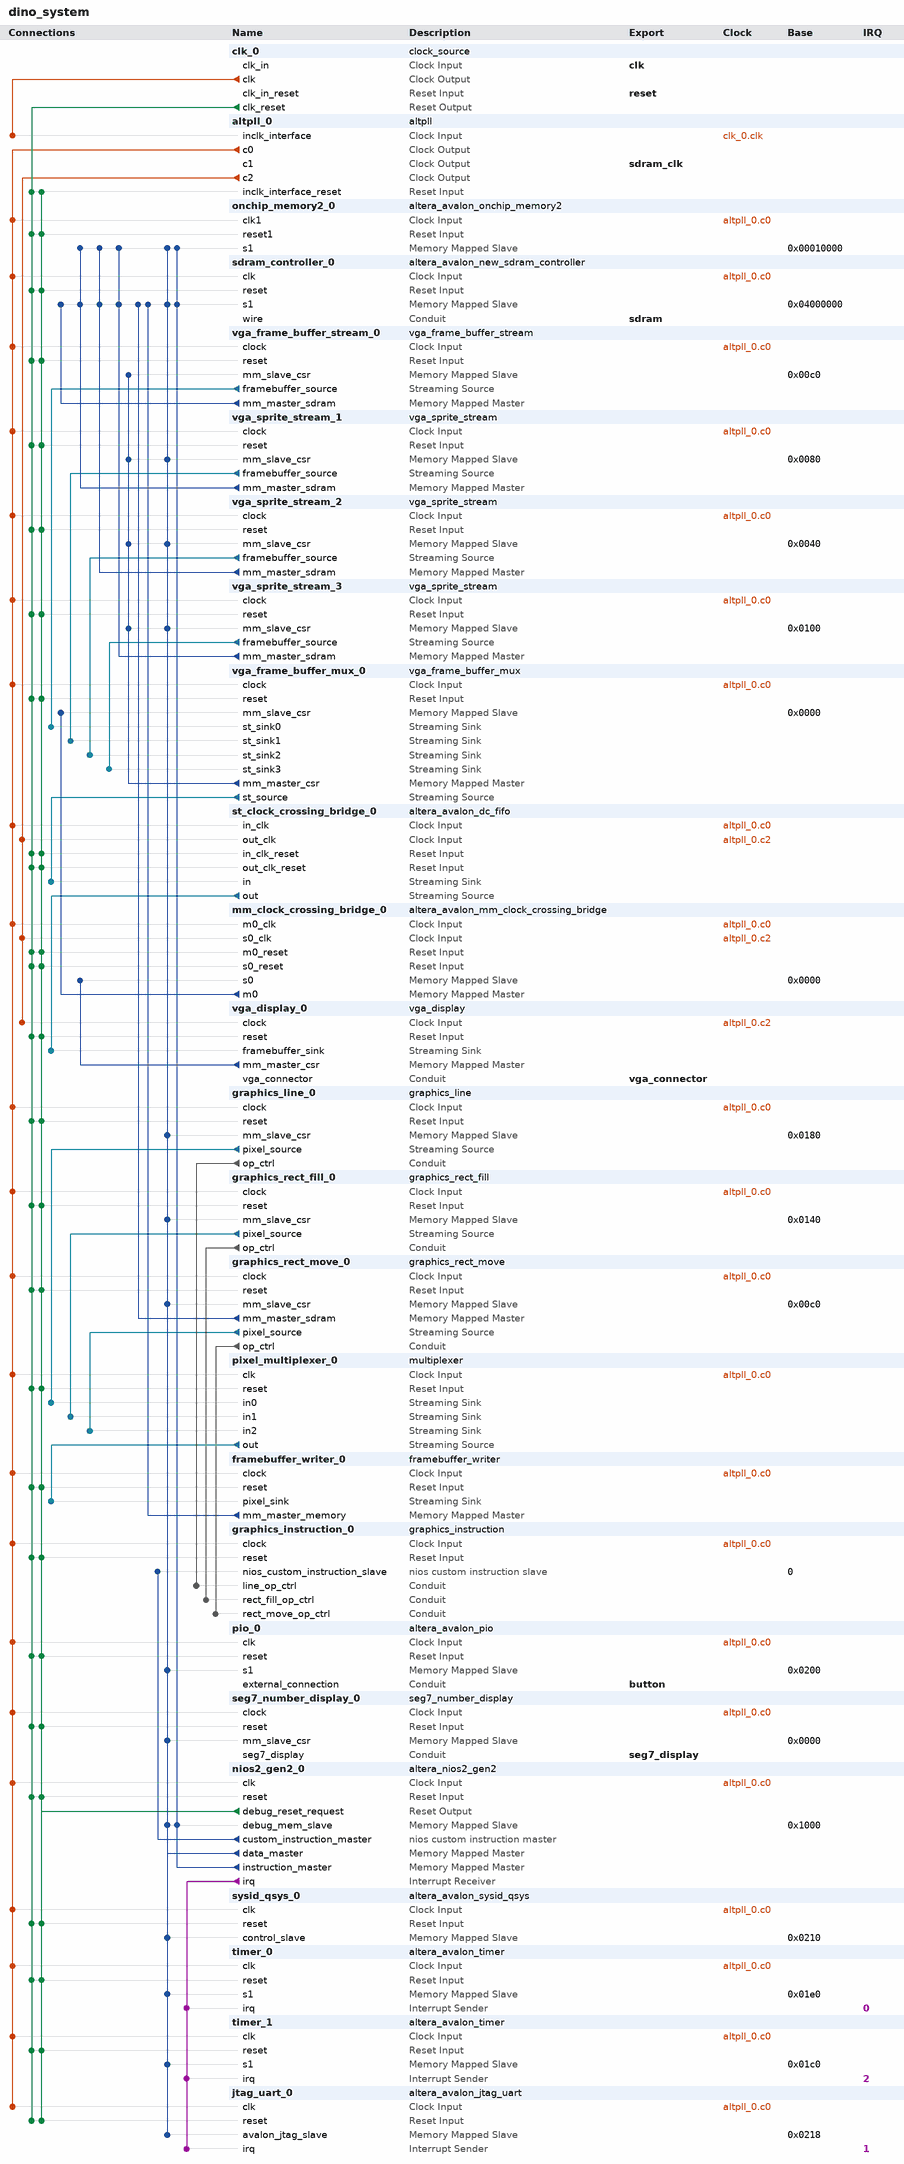
[diagram p0: system contents]
# Platform Designer (Qsys) system dino_system, MAX 10 10M50DAF484C7G
# Parameters at their usual value, and those the tool derives, are not listed.
package require -exact qsys 20.1
create_system dino_system
set_project_property DEVICE_FAMILY {MAX 10}
set_project_property DEVICE 10M50DAF484C7G

add_instance clk_0 clock_source 20.1
set_instance_parameter_value clk_0 clockFrequency 50000000

add_instance altpll_0 altpll 20.1
set_instance_parameter_value altpll_0 CLK0_DIVIDE_BY 5
set_instance_parameter_value altpll_0 CLK0_MULTIPLY_BY 6
set_instance_parameter_value altpll_0 CLK1_DIVIDE_BY 5
set_instance_parameter_value altpll_0 CLK1_DUTY_CYCLE 50
set_instance_parameter_value altpll_0 CLK1_MULTIPLY_BY 6
set_instance_parameter_value altpll_0 CLK1_PHASE_SHIFT 0
set_instance_parameter_value altpll_0 CLK2_DIVIDE_BY 2
set_instance_parameter_value altpll_0 CLK2_DUTY_CYCLE 50
set_instance_parameter_value altpll_0 CLK2_MULTIPLY_BY 1
set_instance_parameter_value altpll_0 CLK2_PHASE_SHIFT 0
set_instance_parameter_value altpll_0 INCLK0_INPUT_FREQUENCY 20000
set_instance_parameter_value altpll_0 PORT_ARESET PORT_USED
set_instance_parameter_value altpll_0 PORT_LOCKED PORT_USED
set_instance_parameter_value altpll_0 PORT_clk1 PORT_USED
set_instance_parameter_value altpll_0 PORT_clk2 PORT_USED
set_instance_parameter_value altpll_0 PORT_clk3 PORT_UNUSED

add_instance onchip_memory2_0 altera_avalon_onchip_memory2 20.1
set_instance_parameter_value onchip_memory2_0 dataWidth 32
set_instance_parameter_value onchip_memory2_0 dualPort false
set_instance_parameter_value onchip_memory2_0 initMemContent false
set_instance_parameter_value onchip_memory2_0 initializationFileName onchip_mem.hex
set_instance_parameter_value onchip_memory2_0 memorySize 32768

add_instance sdram_controller_0 altera_avalon_new_sdram_controller 20.1
set_instance_parameter_value sdram_controller_0 TAC 5.4
set_instance_parameter_value sdram_controller_0 TRCD 15.0
set_instance_parameter_value sdram_controller_0 TRP 15.0
set_instance_parameter_value sdram_controller_0 casLatency 3
set_instance_parameter_value sdram_controller_0 columnWidth 10
set_instance_parameter_value sdram_controller_0 dataWidth 16
set_instance_parameter_value sdram_controller_0 generateSimulationModel true
set_instance_parameter_value sdram_controller_0 model single_Micron_MT48LC4M32B2_7_chip
set_instance_parameter_value sdram_controller_0 numberOfBanks 4
set_instance_parameter_value sdram_controller_0 numberOfChipSelects 1
set_instance_parameter_value sdram_controller_0 powerUpDelay 100.0
set_instance_parameter_value sdram_controller_0 refreshPeriod 7.8125
set_instance_parameter_value sdram_controller_0 rowWidth 13

add_instance vga_frame_buffer_stream_0 vga_frame_buffer_stream 1.0
set_instance_parameter_value vga_frame_buffer_stream_0 MM_START_ADDRESS 67108864

add_instance vga_sprite_stream_1 vga_sprite_stream 1.0
set_instance_parameter_value vga_sprite_stream_1 MM_START_ADDRESS 67108864
set_instance_parameter_value vga_sprite_stream_1 SPRITE_HEIGHT 48
set_instance_parameter_value vga_sprite_stream_1 SPRITE_WIDTH 48

add_instance vga_sprite_stream_2 vga_sprite_stream 1.0
set_instance_parameter_value vga_sprite_stream_2 MM_START_ADDRESS 67108864
set_instance_parameter_value vga_sprite_stream_2 SPRITE_HEIGHT 48
set_instance_parameter_value vga_sprite_stream_2 SPRITE_WIDTH 48

add_instance vga_sprite_stream_3 vga_sprite_stream 1.0
set_instance_parameter_value vga_sprite_stream_3 MM_START_ADDRESS 67108864
set_instance_parameter_value vga_sprite_stream_3 SPRITE_HEIGHT 48
set_instance_parameter_value vga_sprite_stream_3 SPRITE_WIDTH 48

add_instance vga_frame_buffer_mux_0 vga_frame_buffer_mux 1.0
set_instance_parameter_value vga_frame_buffer_mux_0 MM_CSR_ADDRESS_SOURCE0 192
set_instance_parameter_value vga_frame_buffer_mux_0 MM_CSR_ADDRESS_SOURCE1 128
set_instance_parameter_value vga_frame_buffer_mux_0 MM_CSR_ADDRESS_SOURCE2 64
set_instance_parameter_value vga_frame_buffer_mux_0 MM_CSR_ADDRESS_SOURCE3 256

add_instance st_clock_crossing_bridge_0 altera_avalon_dc_fifo 20.1
set_instance_parameter_value st_clock_crossing_bridge_0 BITS_PER_SYMBOL 8
set_instance_parameter_value st_clock_crossing_bridge_0 FIFO_DEPTH 16
set_instance_parameter_value st_clock_crossing_bridge_0 RD_SYNC_DEPTH 2
set_instance_parameter_value st_clock_crossing_bridge_0 SYMBOLS_PER_BEAT 2
set_instance_parameter_value st_clock_crossing_bridge_0 USE_PACKETS 1
set_instance_parameter_value st_clock_crossing_bridge_0 WR_SYNC_DEPTH 2

add_instance mm_clock_crossing_bridge_0 altera_avalon_mm_clock_crossing_bridge 20.1
set_instance_parameter_value mm_clock_crossing_bridge_0 ADDRESS_WIDTH 32
set_instance_parameter_value mm_clock_crossing_bridge_0 COMMAND_FIFO_DEPTH 4
set_instance_parameter_value mm_clock_crossing_bridge_0 DATA_WIDTH 32
set_instance_parameter_value mm_clock_crossing_bridge_0 MASTER_SYNC_DEPTH 2
set_instance_parameter_value mm_clock_crossing_bridge_0 MAX_BURST_SIZE 1
set_instance_parameter_value mm_clock_crossing_bridge_0 RESPONSE_FIFO_DEPTH 4
set_instance_parameter_value mm_clock_crossing_bridge_0 SLAVE_SYNC_DEPTH 2
set_instance_parameter_value mm_clock_crossing_bridge_0 USE_AUTO_ADDRESS_WIDTH 0

add_instance vga_display_0 vga_display 1.0
set_instance_parameter_value vga_display_0 MM_CSR_START_ADDRESS 0
set_instance_parameter_value vga_display_0 ST_DATA_WIDTH 16

add_instance graphics_line_0 graphics_line 1.0

add_instance graphics_rect_fill_0 graphics_rect_fill 1.0

add_instance graphics_rect_move_0 graphics_rect_move 1.0
set_instance_parameter_value graphics_rect_move_0 MAX_PENDING_READS 50
set_instance_parameter_value graphics_rect_move_0 MM_START_ADDRESS 67108864

add_instance pixel_multiplexer_0 multiplexer 20.1
set_instance_parameter_value pixel_multiplexer_0 bitsPerSymbol 8
set_instance_parameter_value pixel_multiplexer_0 errorWidth 0
set_instance_parameter_value pixel_multiplexer_0 numInputInterfaces 3
set_instance_parameter_value pixel_multiplexer_0 outChannelWidth 2
set_instance_parameter_value pixel_multiplexer_0 packetScheduling false
set_instance_parameter_value pixel_multiplexer_0 schedulingSize 1
set_instance_parameter_value pixel_multiplexer_0 symbolsPerBeat 6
set_instance_parameter_value pixel_multiplexer_0 useHighBitsOfChannel true
set_instance_parameter_value pixel_multiplexer_0 usePackets false

add_instance framebuffer_writer_0 framebuffer_writer 1.0
set_instance_parameter_value framebuffer_writer_0 MM_START_ADDRESS 67108864

add_instance graphics_instruction_0 graphics_instruction 1.0

add_instance pio_0 altera_avalon_pio 20.1
set_instance_parameter_value pio_0 direction Input
set_instance_parameter_value pio_0 width 1

add_instance seg7_number_display_0 seg7_number_display 1.0
set_instance_parameter_value seg7_number_display_0 BCD_DIGITS 6
set_instance_parameter_value seg7_number_display_0 BINARY_DATA_WIDTH 32
set_instance_parameter_value seg7_number_display_0 CSR_ADDR_WIDTH 4
set_instance_parameter_value seg7_number_display_0 CSR_DATA_WIDTH 32

add_instance nios2_gen2_0 altera_nios2_gen2 20.1
set_instance_parameter_value nios2_gen2_0 dcache_size 0
set_instance_parameter_value nios2_gen2_0 debug_hwbreakpoint 2
set_instance_parameter_value nios2_gen2_0 exceptionSlave onchip_memory2_0.s1
set_instance_parameter_value nios2_gen2_0 icache_size 0
set_instance_parameter_value nios2_gen2_0 impl Tiny
set_instance_parameter_value nios2_gen2_0 resetSlave onchip_memory2_0.s1

add_instance sysid_qsys_0 altera_avalon_sysid_qsys 20.1
set_instance_parameter_value sysid_qsys_0 id 268435457

add_instance timer_0 altera_avalon_timer 20.1
set_instance_parameter_value timer_0 period 10
set_instance_parameter_value timer_0 periodUnits MSEC

add_instance timer_1 altera_avalon_timer 20.1
set_instance_parameter_value timer_1 period 10
set_instance_parameter_value timer_1 periodUnits MSEC

add_instance jtag_uart_0 altera_avalon_jtag_uart 20.1
set_instance_parameter_value jtag_uart_0 simInteractiveOptions NO_INTERACTIVE_WINDOWS

# connections
add_connection altpll_0.c0 framebuffer_writer_0.clock clock
add_connection altpll_0.c0 graphics_instruction_0.clock clock
add_connection altpll_0.c0 graphics_line_0.clock clock
add_connection altpll_0.c0 graphics_rect_fill_0.clock clock
add_connection altpll_0.c0 graphics_rect_move_0.clock clock
add_connection altpll_0.c0 jtag_uart_0.clk clock
add_connection altpll_0.c0 mm_clock_crossing_bridge_0.m0_clk clock
add_connection altpll_0.c0 nios2_gen2_0.clk clock
add_connection altpll_0.c0 onchip_memory2_0.clk1 clock
add_connection altpll_0.c0 pio_0.clk clock
add_connection altpll_0.c0 pixel_multiplexer_0.clk clock
add_connection altpll_0.c0 sdram_controller_0.clk clock
add_connection altpll_0.c0 seg7_number_display_0.clock clock
add_connection altpll_0.c0 st_clock_crossing_bridge_0.in_clk clock
add_connection altpll_0.c0 sysid_qsys_0.clk clock
add_connection altpll_0.c0 timer_0.clk clock
add_connection altpll_0.c0 timer_1.clk clock
add_connection altpll_0.c0 vga_frame_buffer_mux_0.clock clock
add_connection altpll_0.c0 vga_frame_buffer_stream_0.clock clock
add_connection altpll_0.c0 vga_sprite_stream_1.clock clock
add_connection altpll_0.c0 vga_sprite_stream_2.clock clock
add_connection altpll_0.c0 vga_sprite_stream_3.clock clock
add_connection altpll_0.c2 mm_clock_crossing_bridge_0.s0_clk clock
add_connection altpll_0.c2 st_clock_crossing_bridge_0.out_clk clock
add_connection altpll_0.c2 vga_display_0.clock clock
add_connection clk_0.clk altpll_0.inclk_interface clock
add_connection clk_0.clk_reset altpll_0.inclk_interface_reset reset
add_connection clk_0.clk_reset framebuffer_writer_0.reset reset
add_connection clk_0.clk_reset graphics_instruction_0.reset reset
add_connection clk_0.clk_reset graphics_line_0.reset reset
add_connection clk_0.clk_reset graphics_rect_fill_0.reset reset
add_connection clk_0.clk_reset graphics_rect_move_0.reset reset
add_connection clk_0.clk_reset jtag_uart_0.reset reset
add_connection clk_0.clk_reset mm_clock_crossing_bridge_0.m0_reset reset
add_connection clk_0.clk_reset mm_clock_crossing_bridge_0.s0_reset reset
add_connection clk_0.clk_reset nios2_gen2_0.reset reset
add_connection clk_0.clk_reset onchip_memory2_0.reset1 reset
add_connection clk_0.clk_reset pio_0.reset reset
add_connection clk_0.clk_reset pixel_multiplexer_0.reset reset
add_connection clk_0.clk_reset sdram_controller_0.reset reset
add_connection clk_0.clk_reset seg7_number_display_0.reset reset
add_connection clk_0.clk_reset st_clock_crossing_bridge_0.in_clk_reset reset
add_connection clk_0.clk_reset st_clock_crossing_bridge_0.out_clk_reset reset
add_connection clk_0.clk_reset sysid_qsys_0.reset reset
add_connection clk_0.clk_reset timer_0.reset reset
add_connection clk_0.clk_reset timer_1.reset reset
add_connection clk_0.clk_reset vga_display_0.reset reset
add_connection clk_0.clk_reset vga_frame_buffer_mux_0.reset reset
add_connection clk_0.clk_reset vga_frame_buffer_stream_0.reset reset
add_connection clk_0.clk_reset vga_sprite_stream_1.reset reset
add_connection clk_0.clk_reset vga_sprite_stream_2.reset reset
add_connection clk_0.clk_reset vga_sprite_stream_3.reset reset
add_connection nios2_gen2_0.debug_reset_request altpll_0.inclk_interface_reset reset
add_connection nios2_gen2_0.debug_reset_request framebuffer_writer_0.reset reset
add_connection nios2_gen2_0.debug_reset_request graphics_instruction_0.reset reset
add_connection nios2_gen2_0.debug_reset_request graphics_line_0.reset reset
add_connection nios2_gen2_0.debug_reset_request graphics_rect_fill_0.reset reset
add_connection nios2_gen2_0.debug_reset_request graphics_rect_move_0.reset reset
add_connection nios2_gen2_0.debug_reset_request jtag_uart_0.reset reset
add_connection nios2_gen2_0.debug_reset_request mm_clock_crossing_bridge_0.m0_reset reset
add_connection nios2_gen2_0.debug_reset_request mm_clock_crossing_bridge_0.s0_reset reset
add_connection nios2_gen2_0.debug_reset_request nios2_gen2_0.reset reset
add_connection nios2_gen2_0.debug_reset_request onchip_memory2_0.reset1 reset
add_connection nios2_gen2_0.debug_reset_request pio_0.reset reset
add_connection nios2_gen2_0.debug_reset_request pixel_multiplexer_0.reset reset
add_connection nios2_gen2_0.debug_reset_request sdram_controller_0.reset reset
add_connection nios2_gen2_0.debug_reset_request seg7_number_display_0.reset reset
add_connection nios2_gen2_0.debug_reset_request st_clock_crossing_bridge_0.in_clk_reset reset
add_connection nios2_gen2_0.debug_reset_request st_clock_crossing_bridge_0.out_clk_reset reset
add_connection nios2_gen2_0.debug_reset_request sysid_qsys_0.reset reset
add_connection nios2_gen2_0.debug_reset_request timer_0.reset reset
add_connection nios2_gen2_0.debug_reset_request timer_1.reset reset
add_connection nios2_gen2_0.debug_reset_request vga_display_0.reset reset
add_connection nios2_gen2_0.debug_reset_request vga_frame_buffer_mux_0.reset reset
add_connection nios2_gen2_0.debug_reset_request vga_frame_buffer_stream_0.reset reset
add_connection nios2_gen2_0.debug_reset_request vga_sprite_stream_1.reset reset
add_connection nios2_gen2_0.debug_reset_request vga_sprite_stream_2.reset reset
add_connection nios2_gen2_0.debug_reset_request vga_sprite_stream_3.reset reset
add_connection framebuffer_writer_0.mm_master_memory sdram_controller_0.s1 avalon
set_connection_parameter_value framebuffer_writer_0.mm_master_memory/sdram_controller_0.s1 arbitrationPriority 3
set_connection_parameter_value framebuffer_writer_0.mm_master_memory/sdram_controller_0.s1 baseAddress 0x04000000
add_connection graphics_rect_move_0.mm_master_sdram sdram_controller_0.s1 avalon
set_connection_parameter_value graphics_rect_move_0.mm_master_sdram/sdram_controller_0.s1 arbitrationPriority 7
set_connection_parameter_value graphics_rect_move_0.mm_master_sdram/sdram_controller_0.s1 baseAddress 0x04000000
add_connection mm_clock_crossing_bridge_0.m0 vga_frame_buffer_mux_0.mm_slave_csr avalon
set_connection_parameter_value mm_clock_crossing_bridge_0.m0/vga_frame_buffer_mux_0.mm_slave_csr baseAddress 0x0000
add_connection nios2_gen2_0.data_master graphics_line_0.mm_slave_csr avalon
set_connection_parameter_value nios2_gen2_0.data_master/graphics_line_0.mm_slave_csr baseAddress 0x0180
add_connection nios2_gen2_0.data_master graphics_rect_fill_0.mm_slave_csr avalon
set_connection_parameter_value nios2_gen2_0.data_master/graphics_rect_fill_0.mm_slave_csr baseAddress 0x0140
add_connection nios2_gen2_0.data_master graphics_rect_move_0.mm_slave_csr avalon
set_connection_parameter_value nios2_gen2_0.data_master/graphics_rect_move_0.mm_slave_csr baseAddress 0x00c0
add_connection nios2_gen2_0.data_master jtag_uart_0.avalon_jtag_slave avalon
set_connection_parameter_value nios2_gen2_0.data_master/jtag_uart_0.avalon_jtag_slave baseAddress 0x0218
add_connection nios2_gen2_0.data_master nios2_gen2_0.debug_mem_slave avalon
set_connection_parameter_value nios2_gen2_0.data_master/nios2_gen2_0.debug_mem_slave baseAddress 0x1000
add_connection nios2_gen2_0.data_master onchip_memory2_0.s1 avalon
set_connection_parameter_value nios2_gen2_0.data_master/onchip_memory2_0.s1 baseAddress 0x00010000
add_connection nios2_gen2_0.data_master pio_0.s1 avalon
set_connection_parameter_value nios2_gen2_0.data_master/pio_0.s1 baseAddress 0x0200
add_connection nios2_gen2_0.data_master sdram_controller_0.s1 avalon
set_connection_parameter_value nios2_gen2_0.data_master/sdram_controller_0.s1 arbitrationPriority 2
set_connection_parameter_value nios2_gen2_0.data_master/sdram_controller_0.s1 baseAddress 0x04000000
add_connection nios2_gen2_0.data_master seg7_number_display_0.mm_slave_csr avalon
set_connection_parameter_value nios2_gen2_0.data_master/seg7_number_display_0.mm_slave_csr baseAddress 0x0000
add_connection nios2_gen2_0.data_master sysid_qsys_0.control_slave avalon
set_connection_parameter_value nios2_gen2_0.data_master/sysid_qsys_0.control_slave baseAddress 0x0210
add_connection nios2_gen2_0.data_master timer_0.s1 avalon
set_connection_parameter_value nios2_gen2_0.data_master/timer_0.s1 baseAddress 0x01e0
add_connection nios2_gen2_0.data_master timer_1.s1 avalon
set_connection_parameter_value nios2_gen2_0.data_master/timer_1.s1 baseAddress 0x01c0
add_connection nios2_gen2_0.data_master vga_sprite_stream_1.mm_slave_csr avalon
set_connection_parameter_value nios2_gen2_0.data_master/vga_sprite_stream_1.mm_slave_csr baseAddress 0x0080
add_connection nios2_gen2_0.data_master vga_sprite_stream_2.mm_slave_csr avalon
set_connection_parameter_value nios2_gen2_0.data_master/vga_sprite_stream_2.mm_slave_csr baseAddress 0x0040
add_connection nios2_gen2_0.data_master vga_sprite_stream_3.mm_slave_csr avalon
set_connection_parameter_value nios2_gen2_0.data_master/vga_sprite_stream_3.mm_slave_csr baseAddress 0x0100
add_connection nios2_gen2_0.instruction_master nios2_gen2_0.debug_mem_slave avalon
set_connection_parameter_value nios2_gen2_0.instruction_master/nios2_gen2_0.debug_mem_slave baseAddress 0x1000
add_connection nios2_gen2_0.instruction_master onchip_memory2_0.s1 avalon
set_connection_parameter_value nios2_gen2_0.instruction_master/onchip_memory2_0.s1 baseAddress 0x00010000
add_connection nios2_gen2_0.instruction_master sdram_controller_0.s1 avalon
set_connection_parameter_value nios2_gen2_0.instruction_master/sdram_controller_0.s1 baseAddress 0x04000000
add_connection vga_display_0.mm_master_csr mm_clock_crossing_bridge_0.s0 avalon
set_connection_parameter_value vga_display_0.mm_master_csr/mm_clock_crossing_bridge_0.s0 baseAddress 0x0000
add_connection vga_frame_buffer_mux_0.mm_master_csr vga_frame_buffer_stream_0.mm_slave_csr avalon
set_connection_parameter_value vga_frame_buffer_mux_0.mm_master_csr/vga_frame_buffer_stream_0.mm_slave_csr baseAddress 0x00c0
add_connection vga_frame_buffer_mux_0.mm_master_csr vga_sprite_stream_1.mm_slave_csr avalon
set_connection_parameter_value vga_frame_buffer_mux_0.mm_master_csr/vga_sprite_stream_1.mm_slave_csr baseAddress 0x0080
add_connection vga_frame_buffer_mux_0.mm_master_csr vga_sprite_stream_2.mm_slave_csr avalon
set_connection_parameter_value vga_frame_buffer_mux_0.mm_master_csr/vga_sprite_stream_2.mm_slave_csr baseAddress 0x0040
add_connection vga_frame_buffer_mux_0.mm_master_csr vga_sprite_stream_3.mm_slave_csr avalon
set_connection_parameter_value vga_frame_buffer_mux_0.mm_master_csr/vga_sprite_stream_3.mm_slave_csr baseAddress 0x0100
add_connection vga_frame_buffer_stream_0.mm_master_sdram sdram_controller_0.s1 avalon
set_connection_parameter_value vga_frame_buffer_stream_0.mm_master_sdram/sdram_controller_0.s1 arbitrationPriority 8
set_connection_parameter_value vga_frame_buffer_stream_0.mm_master_sdram/sdram_controller_0.s1 baseAddress 0x04000000
add_connection vga_sprite_stream_1.mm_master_sdram onchip_memory2_0.s1 avalon
set_connection_parameter_value vga_sprite_stream_1.mm_master_sdram/onchip_memory2_0.s1 baseAddress 0x00010000
add_connection vga_sprite_stream_1.mm_master_sdram sdram_controller_0.s1 avalon
set_connection_parameter_value vga_sprite_stream_1.mm_master_sdram/sdram_controller_0.s1 arbitrationPriority 6
set_connection_parameter_value vga_sprite_stream_1.mm_master_sdram/sdram_controller_0.s1 baseAddress 0x04000000
add_connection vga_sprite_stream_2.mm_master_sdram onchip_memory2_0.s1 avalon
set_connection_parameter_value vga_sprite_stream_2.mm_master_sdram/onchip_memory2_0.s1 baseAddress 0x00010000
add_connection vga_sprite_stream_2.mm_master_sdram sdram_controller_0.s1 avalon
set_connection_parameter_value vga_sprite_stream_2.mm_master_sdram/sdram_controller_0.s1 arbitrationPriority 5
set_connection_parameter_value vga_sprite_stream_2.mm_master_sdram/sdram_controller_0.s1 baseAddress 0x04000000
add_connection vga_sprite_stream_3.mm_master_sdram onchip_memory2_0.s1 avalon
set_connection_parameter_value vga_sprite_stream_3.mm_master_sdram/onchip_memory2_0.s1 baseAddress 0x00010000
add_connection vga_sprite_stream_3.mm_master_sdram sdram_controller_0.s1 avalon
set_connection_parameter_value vga_sprite_stream_3.mm_master_sdram/sdram_controller_0.s1 arbitrationPriority 4
set_connection_parameter_value vga_sprite_stream_3.mm_master_sdram/sdram_controller_0.s1 baseAddress 0x04000000
add_connection graphics_line_0.pixel_source pixel_multiplexer_0.in0 avalon_streaming
add_connection graphics_rect_fill_0.pixel_source pixel_multiplexer_0.in1 avalon_streaming
add_connection graphics_rect_move_0.pixel_source pixel_multiplexer_0.in2 avalon_streaming
add_connection pixel_multiplexer_0.out framebuffer_writer_0.pixel_sink avalon_streaming
add_connection st_clock_crossing_bridge_0.out vga_display_0.framebuffer_sink avalon_streaming
add_connection vga_frame_buffer_mux_0.st_source st_clock_crossing_bridge_0.in avalon_streaming
add_connection vga_frame_buffer_stream_0.framebuffer_source vga_frame_buffer_mux_0.st_sink0 avalon_streaming
add_connection vga_sprite_stream_1.framebuffer_source vga_frame_buffer_mux_0.st_sink1 avalon_streaming
add_connection vga_sprite_stream_2.framebuffer_source vga_frame_buffer_mux_0.st_sink2 avalon_streaming
add_connection vga_sprite_stream_3.framebuffer_source vga_frame_buffer_mux_0.st_sink3 avalon_streaming
add_connection graphics_line_0.op_ctrl graphics_instruction_0.line_op_ctrl conduit
add_connection graphics_rect_fill_0.op_ctrl graphics_instruction_0.rect_fill_op_ctrl conduit
add_connection graphics_rect_move_0.op_ctrl graphics_instruction_0.rect_move_op_ctrl conduit
add_connection nios2_gen2_0.irq jtag_uart_0.irq interrupt
set_connection_parameter_value nios2_gen2_0.irq/jtag_uart_0.irq irqNumber 1
add_connection nios2_gen2_0.irq timer_0.irq interrupt
set_connection_parameter_value nios2_gen2_0.irq/timer_0.irq irqNumber 0
add_connection nios2_gen2_0.irq timer_1.irq interrupt
set_connection_parameter_value nios2_gen2_0.irq/timer_1.irq irqNumber 2
add_connection nios2_gen2_0.custom_instruction_master graphics_instruction_0.nios_custom_instruction_slave nios_custom_instruction
set_connection_parameter_value nios2_gen2_0.custom_instruction_master/graphics_instruction_0.nios_custom_instruction_slave CIName graphics_instruction_0
set_connection_parameter_value nios2_gen2_0.custom_instruction_master/graphics_instruction_0.nios_custom_instruction_slave baseAddress 0

# exported interfaces
add_interface button conduit end
set_interface_property button EXPORT_OF pio_0.external_connection
add_interface clk clock sink
set_interface_property clk EXPORT_OF clk_0.clk_in
add_interface reset reset sink
set_interface_property reset EXPORT_OF clk_0.clk_in_reset
add_interface sdram conduit end
set_interface_property sdram EXPORT_OF sdram_controller_0.wire
add_interface sdram_clk clock source
set_interface_property sdram_clk EXPORT_OF altpll_0.c1
add_interface seg7_display conduit end
set_interface_property seg7_display EXPORT_OF seg7_number_display_0.seg7_display
add_interface vga_connector conduit end
set_interface_property vga_connector EXPORT_OF vga_display_0.vga_connector

set_interconnect_requirement {$system} qsys_mm.clockCrossingAdapter HANDSHAKE
set_interconnect_requirement {$system} qsys_mm.enableEccProtection FALSE
set_interconnect_requirement {$system} qsys_mm.enableInstrumentation TRUE
set_interconnect_requirement {$system} qsys_mm.insertDefaultSlave FALSE
set_interconnect_requirement {$system} qsys_mm.maxAdditionalLatency 0
set_interconnect_requirement graphics_line_0.mm_slave_csr qsys_mm.insertPerformanceMonitor FALSE
set_interconnect_requirement jtag_master_0.master qsys_mm.insertPerformanceMonitor FALSE
set_interconnect_requirement {mm_interconnect_0|router_004.src/nios2_gen2_0_instruction_master_limiter.cmd_sink} qsys_mm.postTransform.pipelineCount 0
set_interconnect_requirement nios2_gen2_0.data_master qsys_mm.insertPerformanceMonitor FALSE
set_interconnect_requirement onchip_memory2_0.s1 qsys_mm.insertPerformanceMonitor FALSE
set_interconnect_requirement sdram_controller_0.s1 qsys_mm.arbitrationScheme fixed-priority
set_interconnect_requirement sdram_controller_0.s1 qsys_mm.insertPerformanceMonitor FALSE
set_interconnect_requirement sysid_qsys_0.control_slave qsys_mm.insertPerformanceMonitor FALSE

save_system dino_system.qsys
